# EAGLE design StepperModule (EAGLE 9.2.2)
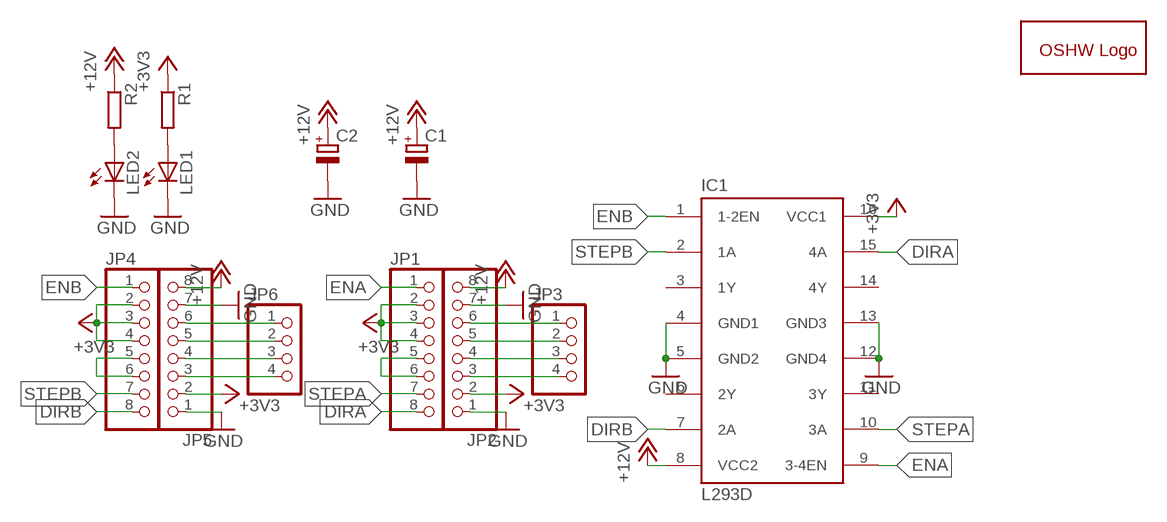
[diagram p0: schematic, sheet 1]

## Parts
C1  CPOL-EUTT5D9  [TT5D9]
C2  CPOL-EUTT5D9  [TT5D9]
IC1  L293D  [L293]
JP1  PINHD-1X8  [1X08]
JP2  PINHD-1X8  [1X08]
JP3  PINHD-1X4  [1X04]
JP4  PINHD-1X8  [1X08]
JP5  PINHD-1X8  [1X08]
JP6  PINHD-1X4  [1X04]
LED1  LEDSML1206  [SML1206]
LED2  LEDSML1206  [SML1206]
R1  R-EU_M1206  [M1206]
R2  R-EU_M1206  [M1206]
U$5  OPENSOURCE  [OSHW_5MM]

## Nets
+3V3: IC1.16(VCC1) JP1.2 JP1.3 JP1.4 JP2.2 JP4.2 JP4.3 JP4.4 JP5.2 R1.1
+12V: C1.+ C2.+ IC1.8(VCC2) JP2.8 JP5.8 R2.1
DIRA: IC1.15(4A) JP1.8
DIRB: IC1.7(2A) JP4.8
ENA: IC1.9(3-4EN) JP1.1
ENB: IC1.1(1-2EN) JP4.1
GND: C1.- C2.- IC1.4(GND1) IC1.5(GND2) IC1.12(GND4) IC1.13(GND3) JP2.1 JP2.7 JP5.1 JP5.7 LED1.C LED2.C
N$1: LED1.A R1.2
N$2: LED2.A R2.2
N$3: JP4.5 JP4.6
N$6: JP1.5 JP1.6
N$9: JP5.3 JP6.4
N$10: JP5.4 JP6.3
N$11: JP2.3 JP3.4
N$12: JP2.4 JP3.3
N$13: JP2.5 JP3.2
N$14: JP2.6 JP3.1
N$15: JP5.5 JP6.2
N$16: JP5.6 JP6.1
STEPA: IC1.10(3A) JP1.7
STEPB: IC1.2(1A) JP4.7
Unconnected: IC1.3(1Y) IC1.6(2Y) IC1.11(3Y) IC1.14(4Y)

## Library data of the parts
C1 C2 = rcl:CPOL-EU: POLARIZED CAPACITOR, European symbol; SPICEPREFIX: C
IC1 = Cing Library:L293D: PUSH-PULL 4 CHANNEL DRIVER; MPN: L293D; OC_FARNELL: 9589619; OC_NEWARK: 56P8249
JP1 JP2 JP4 JP5 = pinhead:PINHD-1X8: PIN HEADER
JP3 JP6 = pinhead:PINHD-1X4: PIN HEADER
LED1 LED2 = led:LED: LED OSRAM: - CHIPLED LG R971, LG N971, LY N971, LG Q971, LY Q971, LO R971, LY R971 LH N974, LH R974 LS Q976, LO Q976, LY Q976 LO Q996 - Hyper CHIPLED LW Q18S LB Q993, LB Q99A, LB R99A - SideLED LS A670, LO A670, LY A670, LG A670, LP A670 LB A673, LV A673, LT A673, LW A673 LH A674 LY A675 LS A676, LA A676, LO A676, LY A676, LW A676 LS A679, LY A679, LG A679 - Hyper Micro SIDELED® LS Y876, LA Y876, LO Y876, LY Y876 LT Y87S - SmartLED LW L88C, LW L88S LB L89C, LB L89S, LG L890 LS L89K, LO L89K, LY L89K LS L896, LA L896, LO L896, LY L896 - TOPLED LS T670, LO T670, LY T670, LG T670, LP T670 LSG T670, LSP T670, LSY T670, LOP T670, LYG T670 LG T671, LOG T671, LSG T671 LB T673, LV T673, LT T673, LW T673 LH T674 LS T676, LA T676, LO T676, LY T676, LB T676, LH T676, LSB T676, LW T676 LB T67C, LV T67C, LT T67C, LS T67K, LO T67K, LY T67K, LW E67C LS E67B, LA E67B, LO E67B, LY E67B, LB E67C, LV E67C, LT E67C LW T67C LS T679, LY T679, LG T679 LS T770, LO T770, LY T770, LG T770, LP T770 LB T773, LV T773, LT T773, LW T773 LH T774 LS E675, LA E675, LY E675, LS T675 LS T776, LA T776, LO T776, LY T776, LB T776 LHGB T686 LT T68C, LB T68C - Hyper Mini TOPLED® LB M676 - Mini TOPLED Santana® LG M470 LS M47K, LO M47K, LY M47K Source: http://www.osram.convergy.de LUXEON: - LUMILED® LXK2-PW12-R00, LXK2-PW12-S00, LXK2-PW14-U00, LXK2-PW14-V00 LXK2-PM12-R00, LXK2-PM12-S00, LXK2-PM14-U00 LXK2-PE12-Q00, LXK2-PE12-R00, LXK2-PE12-S00, LXK2-PE14-T00, LXK2-PE14-U00 LXK2-PB12-K00, LXK2-PB12-L00, LXK2-PB12-M00, LXK2-PB14-N00, LXK2-PB14-P00, LXK2-PB14-Q00 LXK2-PR12-L00, LXK2-PR12-M00, LXK2-PR14-Q00, LXK2-PR14-R00 LXK2-PD12-Q00, LXK2-PD12-R00, LXK2-PD12-S00 LXK2-PH12-R00, LXK2-PH12-S00 LXK2-PL12-P00, LXK2-PL12-Q00, LXK2-PL12-R00 Source: www.luxeon.com KINGBRIGHT: KA-3528ASYC Source: www.kingbright.com
R1 R2 = rcl:R-EU_: RESISTOR, European symbol; SPICEPREFIX: R
U$5 = Cing Library:OPENSOURCE

## Board
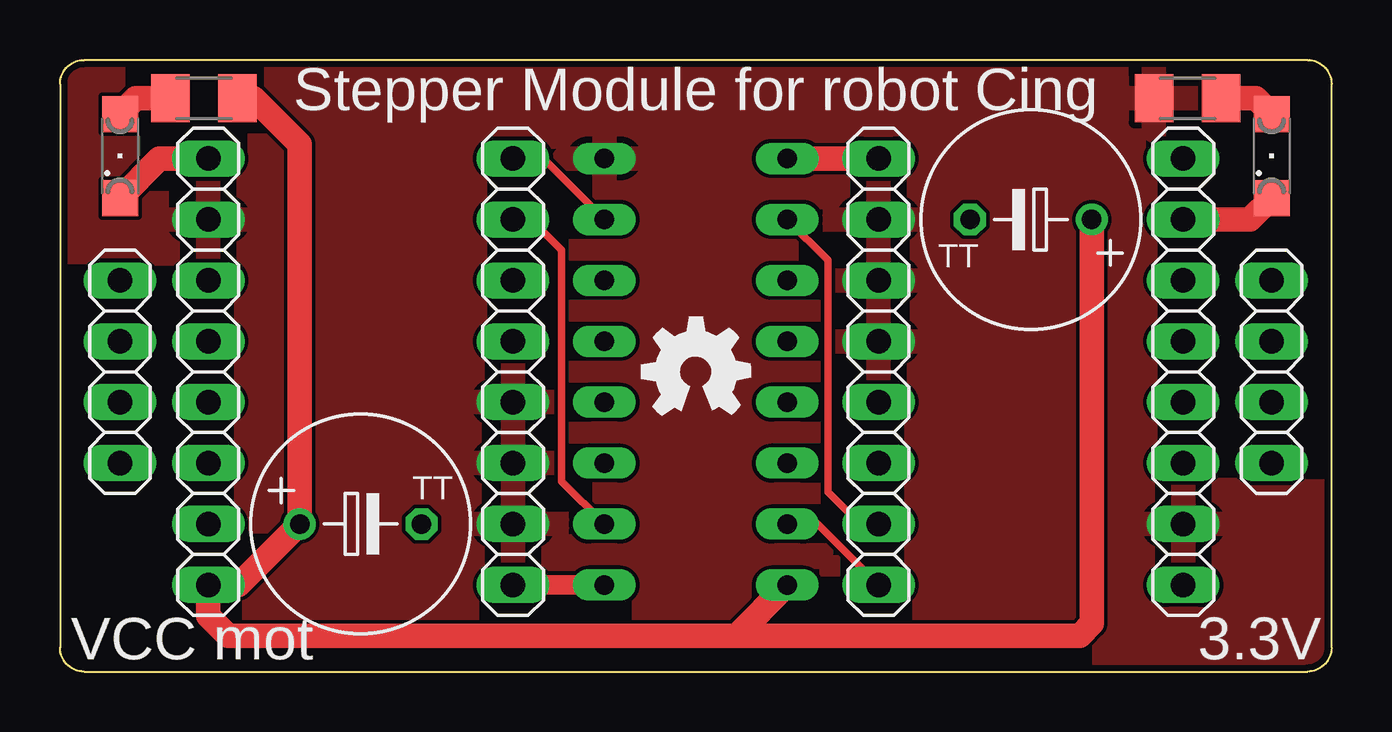
[diagram p1: board, top side]
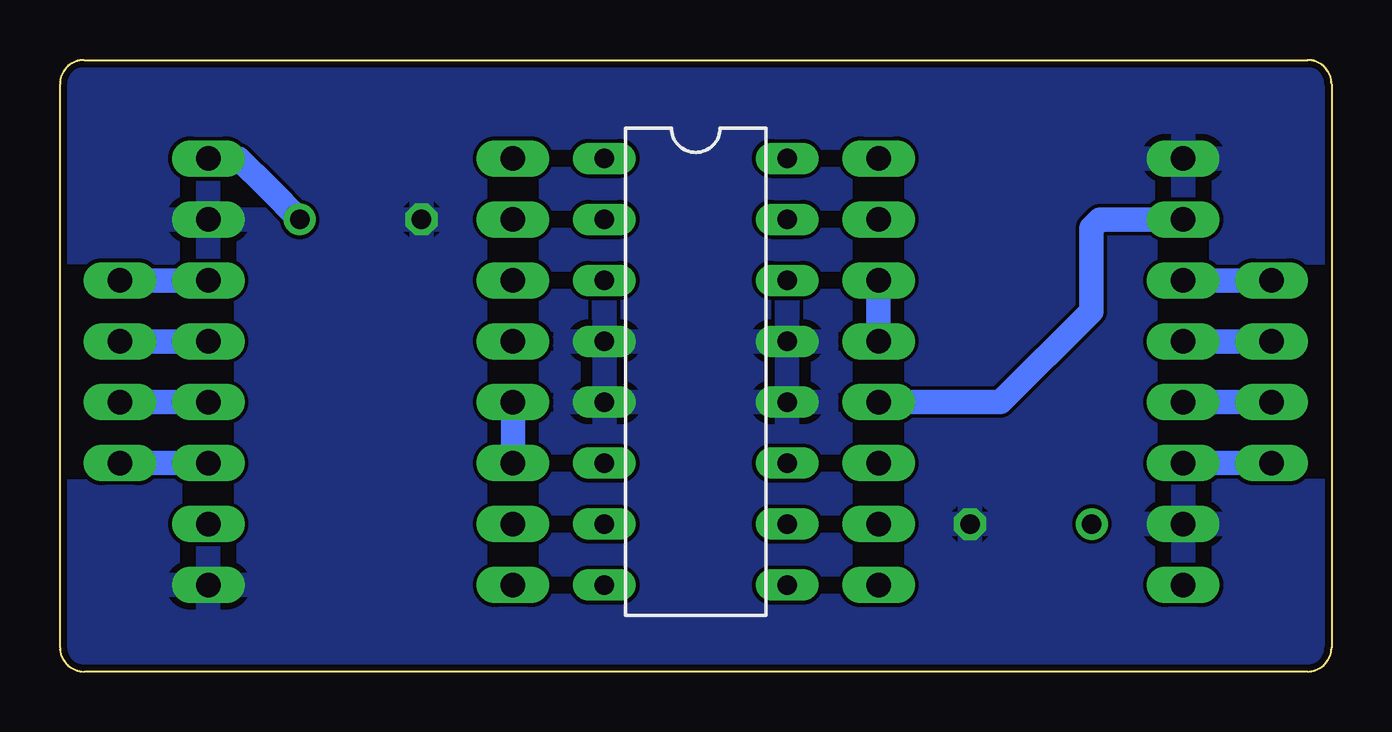
[diagram p2: board, bottom side, seen from below]

Size 53 x 25.5 mm. Coordinates in mm from the lower left corner, seen from the top.
Outline: 53,1 53,24.5 arc90 52,25.5 1,25.5 arc90 0,24.5 0,1 arc90 1,0 52,0 arc90 53,1
Copper layers (1*16): Top 0.035mm / dielectric 1.5mm / Bottom 0.035mm
Design rules "default *": minimum track width 6mil, minimum drill 0.35mm, track to track 6mil, track to pad 6mil, pad to pad 6mil, via to via 6mil, smd to smd 6mil, copper to edge 10mil, drill to drill 6mil, minimum pad ring 10mil, minimum via ring 8mil, stop-mask expansion 4mil, vias tented up to drill 0mil, thermal gap 10mil

### Footprints (pad centres in the part's own frame; a part is rotated, then mirrored left to right if it is on the bottom)
TT5D9 = drill 0.813: + -2.54,0 | drill 0.813 octagon: - 2.54,0
L293 = drill 0.813 long: 1 -8.89,-3.81; 2 -6.35,-3.81; 3 -3.81,-3.81; 4 -1.27,-3.81; 5 1.27,-3.81; 6 3.81,-3.81; 7 6.35,-3.81; 8 8.89,-3.81; 9 8.89,3.81; 10 6.35,3.81; 11 3.81,3.81; 12 1.27,3.81; 13 -1.27,3.81; 14 -3.81,3.81; 15 -6.35,3.81; 16 -8.89,3.81
1X08 = drill 1.016 long: 1 -8.89,0; 2 -6.35,0; 3 -3.81,0; 4 -1.27,0; 5 1.27,0; 6 3.81,0; 7 6.35,0; 8 8.89,0
1X04 = drill 1.016 long: 1 -3.81,0; 2 -1.27,0; 3 1.27,0; 4 3.81,0
SML1206 = smd 1.5 x 1.5: A 1.75,0; C -1.75,0
M1206 = smd 1.6 x 2: 1 -1.4,0; 2 1.4,0

### Placement (x,y rotation side)
C1  12.53,6.15 0 top
C2  40.47,18.85 180 top
IC1  26.5,12.5 270 bottom
JP1  18.88,12.5 90 top
JP2  6.18,12.5 270 top
JP3  2.5,12.5 90 top
JP4  34.12,12.5 270 top
JP5  46.82,12.5 90 top
JP6  50.5,12.5 270 top
LED1  50.5,21.5 90 top
LED2  2.5,21.5 90 top
R1  47,23.9 0 top
R2  6,23.9 180 top
U$5  26.5,12.5 0 top

### Tracks (layer width: path | path; a pad name or v marks a point on that pad's centre or on a via)
+3V3
  Bottom 1.016: JP1.4 13.8,11.23 10.02,15.02 10.02,18.5 9.66,18.85 JP2.2
  pour Top: -1.5,26.5 55.5,26.5 55.5,-2 -1.5,-2
+12V
  Top 1.016: 28.2,1.5 7,1.5 6.18,2.32 JP2.8 7.45,3.61 C1.+ 9.99,21.99 8.08,23.9 R2.1 | 28.2,1.5 IC1.8 | C2.+ 43.01,2.01 42.5,1.5 28.2,1.5
  Bottom 1.016: JP5.8 45.55,21.39 44.33,20.17 C2.+
DIRA
  Top 0.305: IC1.15 20.15,21.39 JP1.8
DIRB
  Top 0.305: IC1.7 31.58,6.15 JP4.8
ENA
  Top 0.813: IC1.9 JP1.1
ENB
  Top 1.016: IC1.1 JP4.1
GND
  Top 1.016: LED1.C 49.6,18.85 JP5.7 | LED2.C 4.14,21.39 JP2.1
  pour Bottom: -1.5,26.5 55.5,26.5 55.5,-1.5 -1.5,-1.5
N$1
  Top 1.016: R1.2 49.85,23.9 LED1.A
N$2
  Top 1.016: LED2.A 3.15,23.9 R2.2
N$3
  Bottom 1.016: JP4.5 JP4.6
N$6
  Bottom 1.016: JP1.6 JP1.5
N$9
  Bottom 1.016: JP5.3 JP6.4
N$10
  Bottom 1.016: JP5.4 JP6.3
N$11
  Bottom 1.016: JP2.3 JP3.4
N$12
  Bottom 1.016: JP2.4 JP3.3
N$13
  Bottom 1.016: JP2.5 JP3.2
N$14
  Bottom 1.016: JP2.6 JP3.1
N$15
  Bottom 1.016: JP5.5 JP6.2
N$16
  Bottom 1.016: JP5.6 JP6.1
STEPA
  Top 0.305: IC1.10 20.91,7.93 20.91,17.58 19.64,18.85 JP1.7
STEPB
  Top 0.305: IC1.2 32,17.16 32,7.5 33.35,6.15 JP4.7

### Text on the board
tPlace: Stepper Module for robot Cing | VCC mot | 3.3V